# Altium project GB2040.PrjPcb
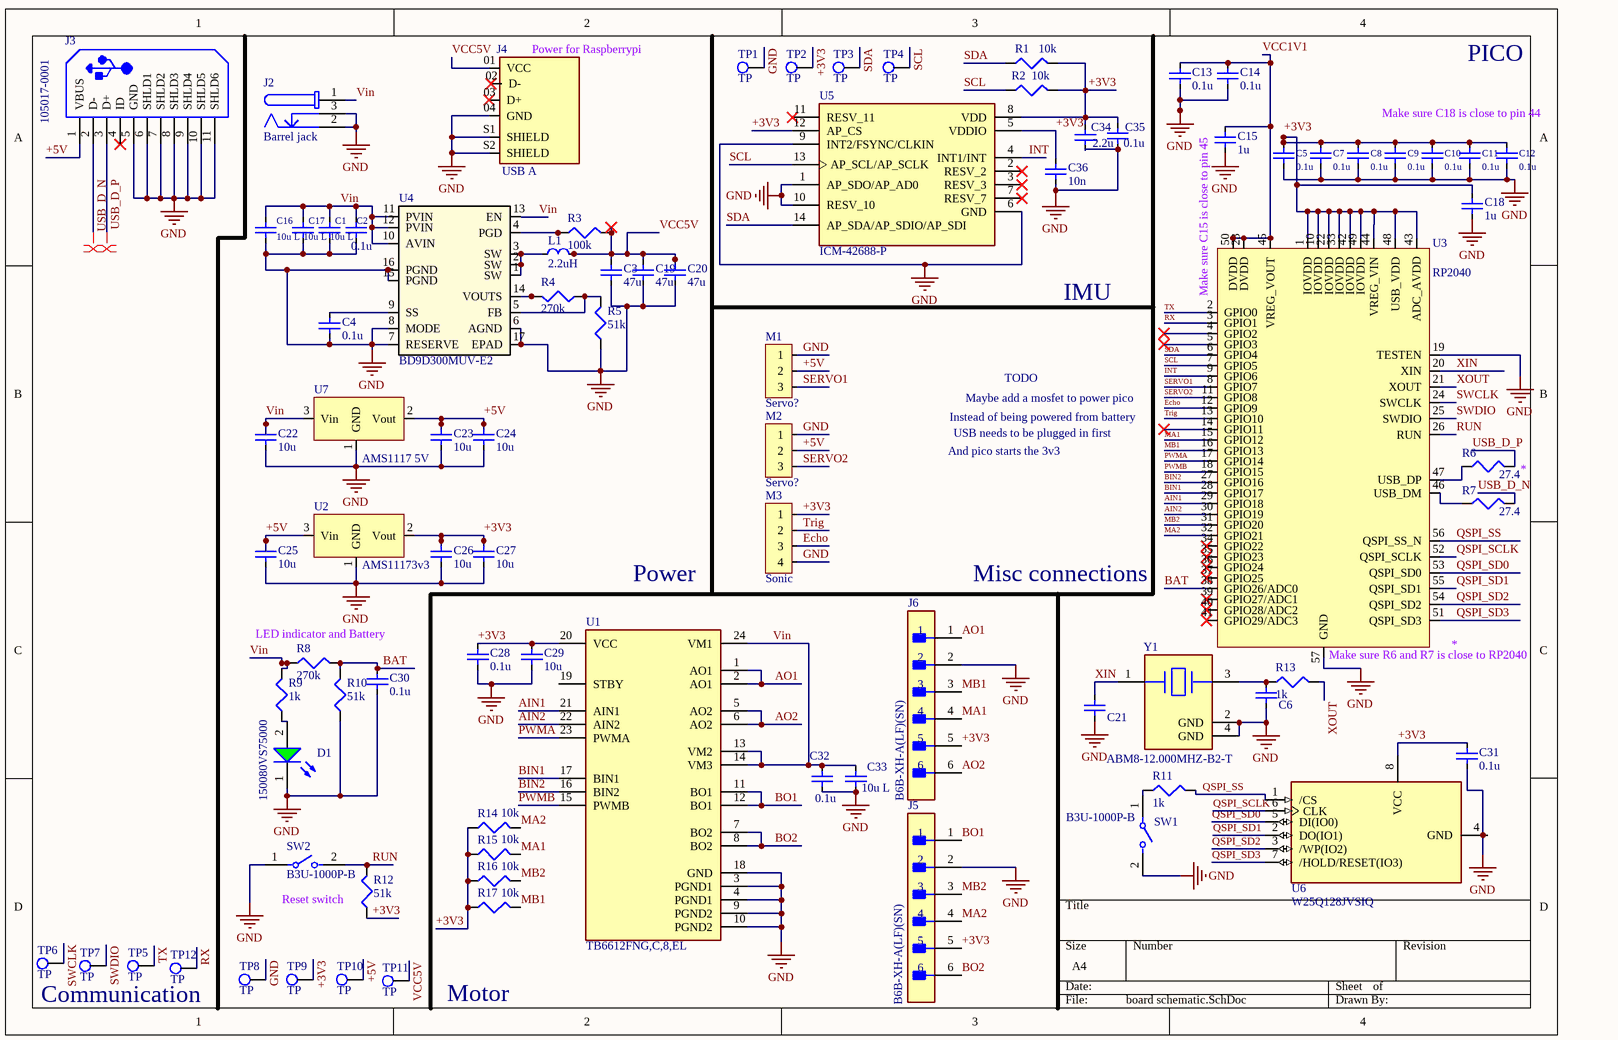
[diagram p0: board schematic.SchDoc]
1 sheet, 85 parts. Net scope: global (net labels, ports and power ports of the same name join across sheets).
Board file: PCB1.PcbDoc

## Sheet board schematic.SchDoc
size A4; SheetNumber: 1; SheetTotal: 1; SPICEModelCacheLHGXSSNS: <root> / <DocumentId>LHGXSSNS</DocumentId> / </root>

### Parts
C1  10u L  [6-0805_M]
C2  0.1u  [Cap 0603]
C3  47u  [1206 cap]
C4  0.1u  [Cap 0603]
C5  0.1u  [Cap 0603]
C6  15p  [Cap 0603]  (value not drawn)
C7  0.1u  [Cap 0603]
C8  0.1u  [Cap 0603]
C9  0.1u  [Cap 0603]
C10  0.1u  [Cap 0603]
C11  0.1u  [Cap 0603]
C12  0.1u  [Cap 0603]
C13  0.1u  [Cap 0603]
C14  0.1u  [Cap 0603]
C15  1u  [Cap 0603]
C16  10u L  [6-0805_M]
C17  10u L  [6-0805_M]
C18  1u  [Cap 0603]
C19  47u  [1206 cap]
C20  47u  [1206 cap]
C21  15p  [Cap 0603]  (value not drawn)
C22  10u  [Cap 0603]
C23  10u  [Cap 0603]
C24  10u  [Cap 0603]
C25  10u  [Cap 0603]
C26  10u  [Cap 0603]
C27  10u  [Cap 0603]
C28  0.1u  [Cap 0603]
C29  10u  [Cap 0603]
C30  0.1u  [Cap 0603]
C31  0.1u  [Cap 0603]
C32  0.1u  [Cap 0603]
C33  10u L  [6-0805_M]
C34  2.2u  [Cap 0603]
C35  0.1u  [Cap 0603]
C36  10n  [Cap 0603]
D1  150080VS75000  [WL-SMCW_0805_150080xx75000]
J2  Barrel jack  [694106301002]
J3  105017-0001  [USB-MICRO-B_V]
J4  USB A  [AMPHENOL_87583-2010RPLF]
J5  B6B-XH-A(LF)(SN)  [FP-B6B-XH-A_LF_SN-MFG]
J6  B6B-XH-A(LF)(SN)  [FP-B6B-XH-A_LF_SN-MFG]
L1  2.2uH  [INDPM5552X300N]
M1  Servo?  [3 Pin tht]
M2  Servo?  [3 Pin tht]
M3  Sonic  [4 Pin tht - duplicate]
R1  10k  [6-0805_M]
R2  10k  [6-0805_M]
R3  100k  [J1-0603]
R4  270k  [J1-0603]
R5  51k  [J1-0603]
R6  27.4  [J1-0603]
R7  27.4  [J1-0603]
R8  270k  [J1-0603]
R9  1k  [J1-0603]
R10  51k  [J1-0603]
R11  1k  [J1-0603]
R12  51k  [J1-0603]
R13  1k  [J1-0603]
R14  10k  [6-0805_M]
R15  10k  [6-0805_M]
R16  10k  [6-0805_M]
R17  10k  [6-0805_M]
SW1  B3U-1000P-B  [FP-B3U-1000P-B-MFG]
SW2  B3U-1000P-B  [FP-B3U-1000P-B-MFG]
TP1  TP  [TP through]  (no BOM)
TP2  TP  [TP through]  (no BOM)
TP3  TP  [TP through]  (no BOM)
TP4  TP  [TP through]  (no BOM)
TP5  TP  [TP through]  (no BOM)
TP6  TP  [TP through]  (no BOM)
TP7  TP  [TP through]  (no BOM)
TP8  TP  [TP through]  (no BOM)
TP9  TP  [TP through]  (no BOM)
TP10  TP  [TP through]  (no BOM)
TP11  TP  [TP through]  (no BOM)
TP12  TP  [TP through]  (no BOM)
U1  TB6612FNG,C,8,EL  [FP-SSOP24-P-300-0_65A-IPC_A]
U2  AMS11173v3  [SOT229P700X180-4N]
U3  RP2040  [QFN-56-GP]
U4  BD9D300MUV-E2  [VQFN16_BD9D300_ROM-M]
U5  ICM-42688-P  [LGA14_2P5X3X0P91_IVS]
U6  W25Q128JVSIQ  [SOIC127P790X216-8N]
U7  AMS1117 5V  [SOT229P700X180-4N]
Y1  ABM8-12.000MHZ-B2-T  [FP-ABM8-MFG]

### Nets
GND: C1.1(pin_1) C2.1(pin_1) C3.1(pin_1) C4.2(pin_2) C5.1(pin_1) C6.1(pin_1) C7.1(pin_1) C8.1(pin_1) C9.1(pin_1) C10.1(pin_1) C11.1(pin_1) C12.1(pin_1) C13.1(pin_1) C14.1(pin_1) C15.1(pin_1) C16.1(pin_1) C17.1(pin_1) C18.1(pin_1) C19.1(pin_1) C20.1(pin_1) C21.1(pin_1) C22.1(pin_1) C23.1(pin_1) C24.1(pin_1) C25.1(pin_1) C26.1(pin_1) C27.1(pin_1) C28.1(pin_1) C29.1(pin_1) C30.1(pin_1) C31.2(pin_2) C32.1(pin_1) C33.1(pin_1) C34.1(pin_1) C35.1(pin_1) C36.1(pin_1) D1.1(K) J2.2 J2.3 J3.5(GND) J3.6(SHLD1) J3.7(SHLD2) J3.8(SHLD3) J3.9(SHLD4) J3.10(SHLD5) J3.11(SHLD6) J4.04(GND) J4.S1(SHIELD) J4.S2(SHIELD) J5.2 J6.2 M1.1 M2.1 M3.4 R5.1 R10.1 SW1.2 SW2.1 TP1.1(P1) TP8.1(P1) U1.3(PGND1) U1.4(PGND1) U1.9(PGND2) U1.10(PGND2) U1.18(GND) U2.1(GND) U3.19(TESTEN) U3.57(GND) U4.6(AGND) U4.7(RESERVE) U4.8(MODE) U4.15(PGND) U4.16(PGND) U4.17(EPAD) U5.1(AP_SDO/AP_AD0) U5.6(GND) U5.9(INT2/FSYNC/CLKIN) U5.10(RESV_10) U6.4(GND) U7.1(GND) Y1.2(GND) Y1.4(GND)
+3V3: C5.2(pin_2) C7.2(pin_2) C8.2(pin_2) C9.2(pin_2) C10.2(pin_2) C11.2(pin_2) C12.2(pin_2) C18.2(pin_2) C26.2(pin_2) C27.2(pin_2) C28.2(pin_2) C29.2(pin_2) C31.1(pin_1) C34.2(pin_2) C35.2(pin_2) C36.2(pin_2) J5.5 J6.5 M3.1 R1.2 R2.2 R12.1 R14.1 R15.1 R16.1 R17.1 TP2.1(P1) TP9.1(P1) U1.20(VCC) U2.2(Vout) U3.1(IOVDD) U3.10(IOVDD) U3.22(IOVDD) U3.33(IOVDD) U3.42(IOVDD) U3.43(ADC_AVDD) U3.44(VREG_VIN) U3.48(USB_VDD) U3.49(IOVDD) U5.5(VDDIO) U5.8(VDD) U5.12(AP_CS) U6.8(VCC)
+5V: C23.2(pin_2) C24.2(pin_2) C25.2(pin_2) J3.1(VBUS) M1.2 M2.2 TP10.1(P1) U2.3(Vin) U7.2(Vout)
AIN1: U1.21(AIN1) U3.29(GPIO18)
AIN2: U1.22(AIN2) U3.30(GPIO19)
AO1: J6.1 U1.1(AO1) U1.2(AO1)
AO2: J6.6 U1.5(AO2) U1.6(AO2)
BAT: C30.2(pin_2) R8.2 R10.2 U3.38(GPIO26/ADC0)
BIN1: U1.17(BIN1) U3.28(GPIO17)
BIN2: U1.16(BIN2) U3.27(GPIO16)
BO1: J5.1 U1.11(BO1) U1.12(BO1)
BO2: J5.6 U1.7(BO2) U1.8(BO2)
Echo: M3.3 U3.12(GPIO9)
INT: U3.9(GPIO6) U5.4(INT1/INT)
MA1: J6.4 R15.2 U3.15(GPIO12)
MA2: J5.4 R14.2 U3.32(GPIO21)
MB1: J6.3 R17.2 U3.16(GPIO13)
MB2: J5.3 R16.2 U3.31(GPIO20)
PWMA: U1.23(PWMA) U3.17(GPIO14)
PWMB: U1.15(PWMB) U3.18(GPIO15)
QSPI_SCLK: U3.52(QSPI_SCLK) U6.6(CLK)
QSPI_SD0: U3.53(QSPI_SD0) U6.5(DI(IO0))
QSPI_SD1: U3.55(QSPI_SD1) U6.2(DO(IO1))
QSPI_SD2: U3.54(QSPI_SD2) U6.3(/WP(IO2))
QSPI_SD3: U3.51(QSPI_SD3) U6.7(/HOLD/RESET(IO3))
QSPI_SS: R11.2 U3.56(QSPI_SS_N) U6.1(/CS)
RUN: R12.2 SW2.2 U3.26(RUN)
RX: TP12.1(P1) U3.3(GPIO1)
SCL: R2.1 TP4.1(P1) U3.7(GPIO5) U5.13(AP_SCL/AP_SCLK)
SDA: R1.1 TP3.1(P1) U3.6(GPIO4) U5.14(AP_SDA/AP_SDIO/AP_SDI)
SERVO1: M1.3 U3.8(GPIO7)
SERVO2: M2.3 U3.11(GPIO8)
SWCLK: TP6.1(P1) U3.24(SWCLK)
SWDIO: TP7.1(P1) U3.25(SWDIO)
Trig: M3.2 U3.13(GPIO10)
TX: TP5.1(P1) U3.2(GPIO0)
USB_D_N: J3.2(D-) R7.2
USB_D_P: J3.3(D+) R6.2
VCC1V1: C13.2(pin_2) C14.2(pin_2) C15.2(pin_2) U3.23(DVDD) U3.45(VREG_VOUT) U3.50(DVDD)
VCC5V: C3.2(pin_2) C19.2(pin_2) C20.2(pin_2) J4.01(VCC) L1.2 R3.2 TP11.1(P1)
Vin: C1.2(pin_2) C2.2(pin_2) C16.2(pin_2) C17.2(pin_2) C22.2(pin_2) C32.2(pin_2) C33.2(pin_2) J2.1 R8.1 R9.2 U1.13(VM2) U1.14(VM3) U1.24(VM1) U4.10(AVIN) U4.11(PVIN) U4.12(PVIN) U4.13(EN) U7.3(Vin)
XIN: C21.2(pin_2) U3.20(XIN) Y1.1
XOUT: R13.2 U3.21(XOUT)
NetC4_1: C4.1(pin_1) U4.9(SS)
NetC6_2: C6.2(pin_2) R13.1 Y1.3
NetD1_2: D1.2(A) R9.1
NetL1_1: L1.1 U4.1(SW) U4.2(SW) U4.3(SW)
NetR3_1: R3.1 U4.4(PGD)
NetR4_1: R4.1 R5.2 U4.5(FB)
NetR4_2: R4.2 U4.14(VOUTS)
NetR6_1: R6.1 U3.47(USB_DP)
NetR7_1: R7.1 U3.46(USB_DM)
NetR11_1: R11.1 SW1.1

Not connected (* = marked no-connect by the designer): J3 4(ID)*; J4 02(D-)* 03(D+)*; U1 19(STBY); U3 4(GPIO2)* 5(GPIO3)* 14(GPIO11)* 34(GPIO22)* 35(GPIO23)* 36(GPIO24)* 37(GPIO25)* 39(GPIO27/ADC1)* 40(GPIO28/ADC2)* 41(GPIO29/ADC3)*; U5 2(RESV_2)* 3(RESV_3)* 7(RESV_7)* 11(RESV_11)*

### Layout directives
differential pair: USB_D_N, USB_D_P

### Notes on the sheet
- (near J4) Power for Raspberrypi
- Make sure C18 is close to pin 44
- PICO
- IMU
- (near U3) Make sure C15 is close to pin 45
- TODO
- And pico starts the 3v3
- (near U3) Instead of being powered from battery
- USB needs to be plugged in first
- Maybe add a mosfet to power pico
- (near R6) *
- Power
- Misc connections
- LED indicator and Battery
- (near U3) Make sure R6 and R7 is close to RP2040
- (near U3) *
- (near R12) Reset switch
- Communication
- (near TP11) Motor

### Library data of the parts
C1 C16 C17 C33 = Capacitor 10 uf 0805: Creator: Gabriel de Leon
C2 C4 C5 C7-C14 C28 C30-C32 C35 = Capacitor 0.1 uf 0603: Creator: Gabriel de Leon
C3 C19 C20 = Capacitor 47uF 1206: Creator: Gabriel de Leon
C6 C21 = Capacitor 15 pf 0603: Creator: Gabriel de Leon
C15 C18 = Capacitor 1 uf 0603: Capacitor 0.1 uf 0603; Creator: Gabriel de Leon
C22-C27 C29 C36 = Capacitor 10 uf 0603: Creator: Gabriel de Leon
C34 = Capacitor 2.2 uf 0603: Creator: Gabriel de Leon
D1 = CMP-1426-00009-5: NexarPartId: 29717783; Color: Green; Dominant Wavelength: 570nm; Lens Style: Clear, Rectangular; Test Current: 20mA; Max Junction Temperature (Tj): 95°C; Max Reverse Voltage (DC): 5V; Forward Voltage: 2V; Forward Current: 100mA; Viewing Angle: 140°; Power Dissipation: 72mW; Peak Wavelength: 572nm; Luminous Intensity: 40mcd; Max Operating Temperature: 85°C; Case/Package: 0805; Case Code (Metric): 2012; RoHS: Compliant; Packaging: Tape and Reel; Min Operating Temperature: -40°C; Width: 1.25mm; Wavelength: 570nm; Mount: Surface Mount; Length: 2mm; REACH SVHC: Unknown; Height: 700µm; Case Code (Imperial): 0805; Reverse Voltage: 5V
J2 = CMP-1502-00188-2: NexarPartId: 52676100; Voltage Rating (DC): 20V; Gender: Male; Voltage Rating: 24V; Connector Type: Power; Insulation Resistance: 100MΩ; Current Rating: 5A; Shielding: Unshielded; Number of Contacts: 3; Color: Black; Housing Material: Polyamide; Contact Gender: Female; REACH SVHC: Unknown; Termination: Through Hole; Height: 11mm; RoHS: Compliant; Mount: Through Hole; Flammability Rating: UL94 V-0; Packaging: Bulk; Min Operating Temperature: -40°C; Contact Plating: Tin; Max Operating Temperature: 85°C; Operating Supply Voltage: 24V; Contact Material: Gold, Tin
J3 = CMP-2000-05827-1: Micro-USB B Receptacle, Right Angle, Bottom Mount, Surface Mount, with Solder Tabs, -30 to 85 degC, 5-Pin USB, RoHS, Tape and Reel; Manufacturer: Molex; Featured Product: Micro-USBConnectorsUSBConnectors; Other Names: WM1399DKR; Package Version: Rev. F, 12/2012; Number of Contacts: 5; Connector Type: USB-microB; Catalog Drawings: 1050170001; 3D Model: 105017-0001.stp; Mating Products: WM17145-ND-CABLEMICROUSBBTOSTDA1.0MWM17147-ND-CABLEMICROUSBBTOSTDA2.0MWM17146-ND-CABLEMICROUSBBTOSTDA1.5M; PCN Assembly/Origin: ResinSupplier21/Oct/2015; Voltage - Max: 30V; Online Catalog: Molex-MicroUSB; Manufacturer URL: http://www.molex.com/; Package Description: 5-Leads USB, Micro B, Body 7.5 x 5 mm, Pitch 0.65 mm; Datasheet URL: http://www.molex.com/elqNow/elqRedir.htm?ref=http://www.molex.com/webdocs/datasheets/pdf/en-us/1050170001_IO_CONNECTORS.pdf; Ingress Protection: -; Datasheet Version: 03/2016; Mounting Type: BoardCutout,SurfaceMount,RightAngle; Circuits: 5; Standard Package: 1; Package Reference: MICRO-B; Package URL: http://www.molex.com/pdm_docs/sd/1050170001_sd.pdf; Category: Connectors,Interconnects; Series: -; RoHS Information: 1050170001CertofCompliance; Features: Shielded,SolderRetention; Family: USB,DVI,HDMIConnectors; Specifications: -; Gender: Receptacle; Packaging: Digi-Reel®; Mounting Technology: SurfaceMount
J4 = USB type A F: Usb type A female; MF: Amphenol ICC; MP: 87583-2010RPLF; Package: None; Price: None; Value: *; Availability: Unavailable
J5 J6 = CMP-17439-000076-1: CONN HEADER VERT 6POS 2.5MM
L1 = inductor: Inductor IHLP2020CZER3R3M01
M1 M2 = Servo: Servo conncetion
M3 = Sonic: Sonic sensor
R1 R2 R14-R17 = 10k resistor: Resistor; Published: 8-Jun-2000; LatestRevisionDate: 29-May-2009; LatestRevisionNote: IPC-7351 Footprint Added.; PackageReference: J1-0603; Publisher: Altium Limited; PackageDescription: Chip Resistor
R3 = 100k resistor: Published: 8-Jun-2000; LatestRevisionDate: 29-May-2009; LatestRevisionNote: IPC-7351 Footprint Added.; PackageReference: J1-0603; Publisher: Altium Limited; PackageDescription: Chip Resistor
R4 R8 = 270k resistor: 270k 0805 resistor; Published: 8-Jun-2000; LatestRevisionDate: 29-May-2009; LatestRevisionNote: IPC-7351 Footprint Added.; PackageReference: J1-0603; Publisher: Altium Limited; PackageDescription: Chip Resistor
R5 R10 R12 = 51k resistor: Published: 8-Jun-2000; LatestRevisionDate: 29-May-2009; LatestRevisionNote: IPC-7351 Footprint Added.; PackageReference: J1-0603; Publisher: Altium Limited; PackageDescription: Chip Resistor
R6 R7 = 27.4 resistor: Published: 8-Jun-2000; LatestRevisionDate: 29-May-2009; LatestRevisionNote: IPC-7351 Footprint Added.; PackageReference: J1-0603; Publisher: Altium Limited; PackageDescription: Chip Resistor
R9 R11 R13 = 1k resistor: Resistor; Published: 8-Jun-2000; LatestRevisionDate: 29-May-2009; LatestRevisionNote: IPC-7351 Footprint Added.; PackageReference: J1-0603; Publisher: Altium Limited; PackageDescription: Chip Resistor
SW1 SW2 = CMP-08834-000005-1: SWITCH TACTILE SPST-NO 0.05A 12V; Manufacturer: Omron; Operating Force: 1.5N; Contact Current Rating: 50mA; Contact Resistance: 100mΩ; Electromechanical Life: 200000Cycles; Height: 1.75mm; Device Class L2: Switches; Temperature Range High: +70°C; Digikey Description: SWITCH TACTILE SPST-NO 0.05A 12V; Throw Configuration: SPST-NO; Ambient Temperature Range High: +70°C; Temperature: -25°C to +70°C; Lead Free: Yes; ComponentLink2URL: https://omronfs.omron.com/en_US/ecb/products/pdf/en-b3u.pdf; Device Class L3: Tactile Switches; Manufacturer Part Number: B3U-1000P-B; Ambient Temperature Range Low: -25°C; Mount: Surface Mount; Automotive: No; Mouser Description: Tactile Switches Top Actuated with boss w/o ground; Octopart: https://octopart.com/b3u-1000p-b-omron-1057356; RoHS: TRUE; Package: 0; Device Class L1: Electromechanical; Voltage Rating Dc: 12V; Category: Switch; Temperature Range Low: -25°C; ComponentLink2Description: Datasheet
TP1-TP12 = Testpoint
U1 = TB6612FNG: IC MOTOR DRIVER 2.7V-5.5V 24SSOP; Logic Function: AND GATE; Interface: Parallel; Operating Supply Voltage: 3V; Max Supply Voltage: 5.5V; Output Current: 1A; Min Supply Voltage: 2.7V; Number of Outputs: 2; Packaging: Tape and Reel; Mount: Surface Mount; Number of Pins: 24; Min Operating Temperature: -20°C; Case/Package: SSOP; Series: -; Max Operating Temperature: 85°C; Package Quantity: 1
U2 = AMS1117_3V3: 3.3v version of AMS11173v3
U3 = RP2040: Rasberry pi PR2040; Manufacturer: Raspberry Pi; Creater: Gabriel de Leon; Manufacturer Part Number: RP2040
U4 = BD9D300MUV-E2: Switching regualtor 3A 4.7v to 14V; Mfr_Name: ROHM Semiconductor; RefDes: RefDes; Type: Type
U5 = ICM-42688-P: Accelerometer, Gyroscope, 6 Axis Sensor Output; Package: None; MP: ICM-42688-P; Value: *; Availability: Unavailable; Price: None
U6 = W25Q128JVSIQ: FLASH - NOR Memory IC 128Mb (16M x 8) SPI - Quad I/O, QPI, DTR 133 MHz 8-SOIC; MF: Winbond Electronics; Price: None; Purchase-URL: https://pricing.snapeda.com/search/part/W25Q128JVSIQ/?ref=eda; Check_prices: https://www.snapeda.com/parts/W25Q128JVSIQ/Winbond+Electronics/view-part/?ref=eda; Value: *; MP: W25Q128JVSIQ; Package: SOIC-8 Winbond; SnapEDA_Link: https://www.snapeda.com/parts/W25Q128JVSIQ/Winbond+Electronics/view-part/?ref=snap; Availability: In Stock
U7 = AMS1117_5V: 5V version of AMS11173
Y1 = CMP-27762-003220-1: Crystal 12MHz ±20ppm 18pF SMD-4 3.2mm x 2.5mm; ESR (Equivalent Series Resistance): 120R; Frequency Stability: 50ppm; Operating Frequency: 12 MHz; Resistor Type: Ceramic; Tolerance: 20ppm; Load Capacitance: 18pF; Frequency Tolerance: 20ppm; Packaging: Tape and Reel; Frequency: 12MHz; Number of Pins: 4; Case/Package: CSMD; Max Operating Temperature: 70°C; Mount: Surface Mount; Package Quantity: 1000; Radiation Hardening: No; Min Operating Temperature: -20°C; Width: 0.098inch; Lead Free: Lead Free; Height: 0.031inch; Depth: 2.5mm; REACH SVHC: No SVHC; Series: ABM8; Series Resistance: 120R; Length: 3.2mm; Termination: SMD/SMT; RoHS Compliant: Yes